# Vivado block design saturn_top, xc7a200tfbg676-2, Vivado 2023.1
# (continued, part 2 of 4)
current_bd_instance /Receiver

# ---- hierarchy /Receiver/dualDDC10 ----
current_bd_instance /Receiver/dualDDC10
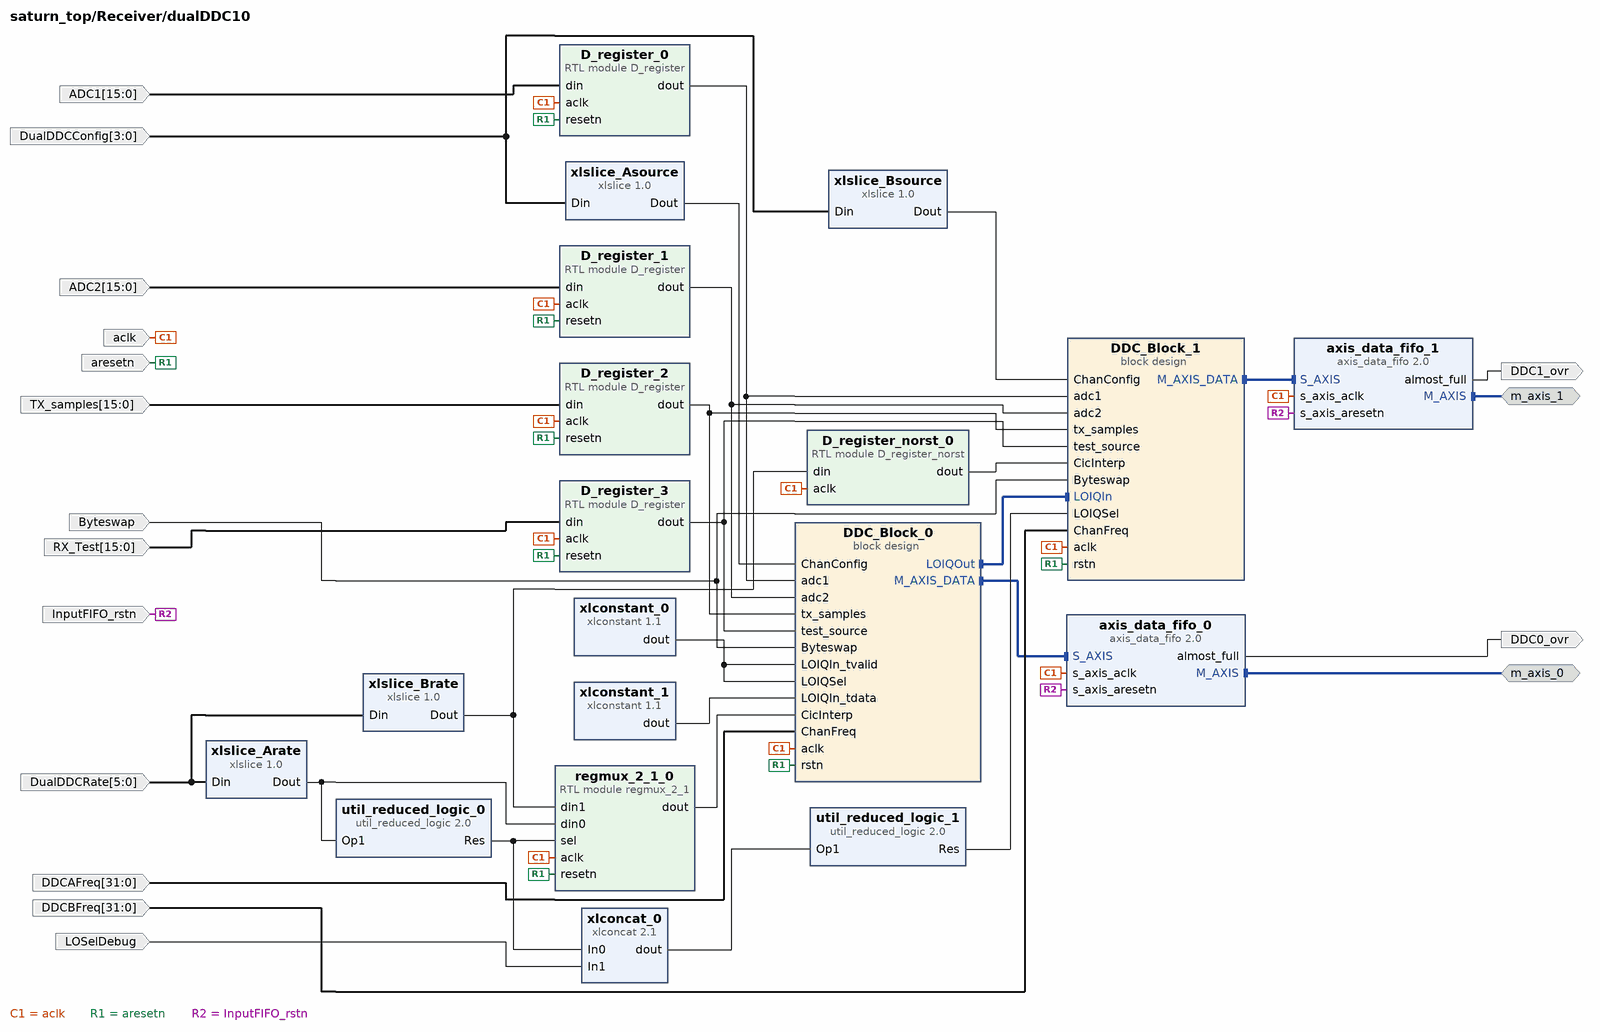
[diagram p13: block diagram inside /Receiver/dualDDC10]
create_bd_intf_pin -mode Master -vlnv xilinx.com:interface:axis_rtl:1.0 m_axis_0
create_bd_intf_pin -mode Master -vlnv xilinx.com:interface:axis_rtl:1.0 m_axis_1
create_bd_pin -dir I -from 15 -to 0 ADC1
create_bd_pin -dir I -from 15 -to 0 ADC2
create_bd_pin -dir I -from 31 -to 0 DDCAFreq
create_bd_pin -dir I -from 31 -to 0 DDCBFreq
create_bd_pin -dir I -from 15 -to 0 RX_Test
create_bd_pin -dir I -from 15 -to 0 TX_samples
create_bd_pin -dir I aclk
create_bd_pin -dir I aresetn
create_bd_pin -dir I -from 5 -to 0 DualDDCRate
create_bd_pin -dir O DDC0_ovr
create_bd_pin -dir O DDC1_ovr
create_bd_pin -dir I InputFIFO_rstn
create_bd_pin -dir I -from 3 -to 0 DualDDCConfig
create_bd_pin -dir I Byteswap
create_bd_pin -dir I LOSelDebug

create_bd_cell -type container -reference DDC_Block DDC_Block_0
set_property -dict [list \
  CONFIG.ACTIVE_SIM_BD DDC_Block.bd \
  CONFIG.ACTIVE_SYNTH_BD DDC_Block.bd \
  CONFIG.ENABLE_DFX 0 \
  CONFIG.LIST_SIM_BD DDC_Block.bd \
  CONFIG.LIST_SYNTH_BD DDC_Block.bd \
  CONFIG.LOCK_PROPAGATE 0 \
] [get_bd_cells DDC_Block_0]
create_bd_cell -type container -reference DDC_Block DDC_Block_1
set_property -dict [list \
  CONFIG.ACTIVE_SIM_BD DDC_Block.bd \
  CONFIG.ACTIVE_SYNTH_BD DDC_Block.bd \
  CONFIG.ENABLE_DFX 0 \
  CONFIG.LIST_SIM_BD DDC_Block.bd \
  CONFIG.LIST_SYNTH_BD DDC_Block.bd \
  CONFIG.LOCK_PROPAGATE 0 \
] [get_bd_cells DDC_Block_1]
create_bd_cell -type ip -vlnv xilinx.com:ip:xlslice:1.0 xlslice_Arate
set_property -dict {CONFIG.DIN_FROM 2 CONFIG.DIN_TO 0 CONFIG.DIN_WIDTH 6 CONFIG.DOUT_WIDTH 3} [get_bd_cells xlslice_Arate]
create_bd_cell -type ip -vlnv xilinx.com:ip:xlslice:1.0 xlslice_Asource
set_property -dict {CONFIG.DIN_FROM 1 CONFIG.DIN_WIDTH 4 CONFIG.DOUT_WIDTH 2} [get_bd_cells xlslice_Asource]
create_bd_cell -type ip -vlnv xilinx.com:ip:xlslice:1.0 xlslice_Brate
set_property -dict {CONFIG.DIN_FROM 5 CONFIG.DIN_TO 3 CONFIG.DIN_WIDTH 6 CONFIG.DOUT_WIDTH 3} [get_bd_cells xlslice_Brate]
create_bd_cell -type ip -vlnv xilinx.com:ip:xlslice:1.0 xlslice_Bsource
set_property -dict {CONFIG.DIN_FROM 3 CONFIG.DIN_TO 2 CONFIG.DIN_WIDTH 4 CONFIG.DOUT_WIDTH 2} [get_bd_cells xlslice_Bsource]
create_bd_cell -type ip -vlnv xilinx.com:ip:util_reduced_logic:2.0 util_reduced_logic_0
set_property -dict {CONFIG.C_SIZE 3} [get_bd_cells util_reduced_logic_0]
create_bd_cell -type module -reference D_register_norst D_register_norst_0
set_property -dict {CONFIG.DATA_WIDTH 3} [get_bd_cells D_register_norst_0]
create_bd_cell -type ip -vlnv xilinx.com:ip:axis_data_fifo:2.0 axis_data_fifo_0
set_property -dict [list \
  CONFIG.FIFO_DEPTH 128 \
  CONFIG.HAS_AFULL 1 \
  CONFIG.HAS_TKEEP 0 \
  CONFIG.HAS_TLAST 0 \
  CONFIG.HAS_TSTRB 0 \
  CONFIG.TDATA_NUM_BYTES 6 \
  CONFIG.TDEST_WIDTH 0 \
  CONFIG.TID_WIDTH 0 \
  CONFIG.TUSER_WIDTH 0 \
] [get_bd_cells axis_data_fifo_0]
create_bd_cell -type ip -vlnv xilinx.com:ip:axis_data_fifo:2.0 axis_data_fifo_1
set_property -dict [list \
  CONFIG.FIFO_DEPTH 128 \
  CONFIG.HAS_AFULL 1 \
  CONFIG.HAS_TKEEP 0 \
  CONFIG.HAS_TLAST 0 \
  CONFIG.HAS_TSTRB 0 \
  CONFIG.TDATA_NUM_BYTES 6 \
  CONFIG.TDEST_WIDTH 0 \
  CONFIG.TID_WIDTH 0 \
  CONFIG.TUSER_WIDTH 0 \
] [get_bd_cells axis_data_fifo_1]
create_bd_cell -type ip -vlnv xilinx.com:ip:xlconstant:1.1 xlconstant_0
set_property -dict {CONFIG.CONST_VAL 0} [get_bd_cells xlconstant_0]
create_bd_cell -type ip -vlnv xilinx.com:ip:xlconstant:1.1 xlconstant_1
set_property -dict {CONFIG.CONST_VAL 0 CONFIG.CONST_WIDTH 32} [get_bd_cells xlconstant_1]
create_bd_cell -type module -reference D_register D_register_0
create_bd_cell -type module -reference D_register D_register_1
create_bd_cell -type module -reference D_register D_register_2
create_bd_cell -type module -reference D_register D_register_3
create_bd_cell -type module -reference regmux_2_1 regmux_2_1_0
set_property -dict {CONFIG.DATA_WIDTH 3} [get_bd_cells regmux_2_1_0]
create_bd_cell -type ip -vlnv xilinx.com:ip:util_reduced_logic:2.0 util_reduced_logic_1
set_property -dict {CONFIG.C_SIZE 2} [get_bd_cells util_reduced_logic_1]
create_bd_cell -type ip -vlnv xilinx.com:ip:xlconcat:2.1 xlconcat_0

# ---- hierarchy /Receiver/dualDDC98 ----
current_bd_instance /Receiver/dualDDC98
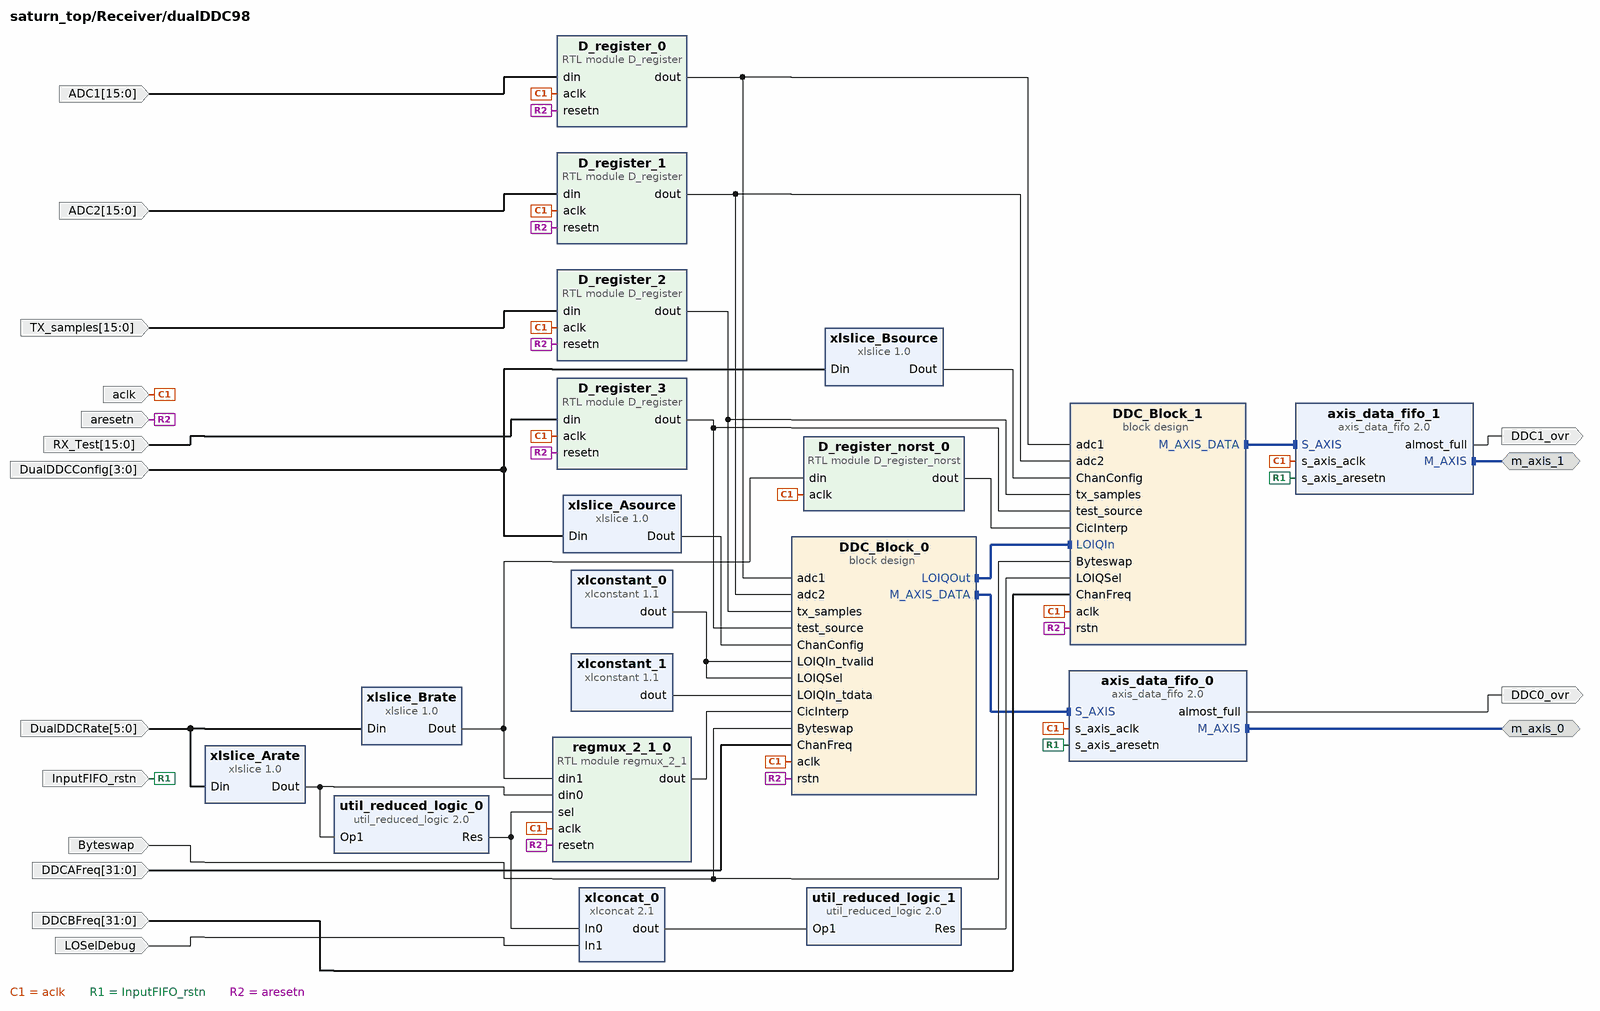
[diagram p14: block diagram inside /Receiver/dualDDC98]
create_bd_intf_pin -mode Master -vlnv xilinx.com:interface:axis_rtl:1.0 m_axis_0
create_bd_intf_pin -mode Master -vlnv xilinx.com:interface:axis_rtl:1.0 m_axis_1
create_bd_pin -dir I -from 15 -to 0 ADC1
create_bd_pin -dir I -from 15 -to 0 ADC2
create_bd_pin -dir O DDC0_ovr
create_bd_pin -dir O DDC1_ovr
create_bd_pin -dir I -from 31 -to 0 DDCAFreq
create_bd_pin -dir I -from 31 -to 0 DDCBFreq
create_bd_pin -dir I -from 5 -to 0 DualDDCRate
create_bd_pin -dir I InputFIFO_rstn
create_bd_pin -dir I -from 15 -to 0 RX_Test
create_bd_pin -dir I -from 15 -to 0 TX_samples
create_bd_pin -dir I aclk
create_bd_pin -dir I aresetn
create_bd_pin -dir I -from 3 -to 0 DualDDCConfig
create_bd_pin -dir I Byteswap
create_bd_pin -dir I LOSelDebug

create_bd_cell -type container -reference DDC_Block DDC_Block_0
set_property -dict [list \
  CONFIG.ACTIVE_SIM_BD DDC_Block.bd \
  CONFIG.ACTIVE_SYNTH_BD DDC_Block.bd \
  CONFIG.ENABLE_DFX 0 \
  CONFIG.LIST_SIM_BD DDC_Block.bd \
  CONFIG.LIST_SYNTH_BD DDC_Block.bd \
  CONFIG.LOCK_PROPAGATE 0 \
] [get_bd_cells DDC_Block_0]
create_bd_cell -type container -reference DDC_Block DDC_Block_1
set_property -dict [list \
  CONFIG.ACTIVE_SIM_BD DDC_Block.bd \
  CONFIG.ACTIVE_SYNTH_BD DDC_Block.bd \
  CONFIG.ENABLE_DFX 0 \
  CONFIG.LIST_SIM_BD DDC_Block.bd \
  CONFIG.LIST_SYNTH_BD DDC_Block.bd \
  CONFIG.LOCK_PROPAGATE 0 \
] [get_bd_cells DDC_Block_1]
create_bd_cell -type ip -vlnv xilinx.com:ip:xlslice:1.0 xlslice_Arate
set_property -dict {CONFIG.DIN_FROM 2 CONFIG.DIN_TO 0 CONFIG.DIN_WIDTH 6 CONFIG.DOUT_WIDTH 3} [get_bd_cells xlslice_Arate]
create_bd_cell -type ip -vlnv xilinx.com:ip:xlslice:1.0 xlslice_Asource
set_property -dict {CONFIG.DIN_FROM 1 CONFIG.DIN_WIDTH 4 CONFIG.DOUT_WIDTH 2} [get_bd_cells xlslice_Asource]
create_bd_cell -type ip -vlnv xilinx.com:ip:xlslice:1.0 xlslice_Brate
set_property -dict {CONFIG.DIN_FROM 5 CONFIG.DIN_TO 3 CONFIG.DIN_WIDTH 6 CONFIG.DOUT_WIDTH 3} [get_bd_cells xlslice_Brate]
create_bd_cell -type ip -vlnv xilinx.com:ip:xlslice:1.0 xlslice_Bsource
set_property -dict {CONFIG.DIN_FROM 3 CONFIG.DIN_TO 2 CONFIG.DIN_WIDTH 4 CONFIG.DOUT_WIDTH 2} [get_bd_cells xlslice_Bsource]
create_bd_cell -type ip -vlnv xilinx.com:ip:util_reduced_logic:2.0 util_reduced_logic_0
set_property -dict {CONFIG.C_SIZE 3} [get_bd_cells util_reduced_logic_0]
create_bd_cell -type module -reference D_register_norst D_register_norst_0
set_property -dict {CONFIG.DATA_WIDTH 3} [get_bd_cells D_register_norst_0]
create_bd_cell -type ip -vlnv xilinx.com:ip:axis_data_fifo:2.0 axis_data_fifo_0
set_property -dict [list \
  CONFIG.FIFO_DEPTH 128 \
  CONFIG.HAS_AFULL 1 \
  CONFIG.HAS_TKEEP 0 \
  CONFIG.HAS_TLAST 0 \
  CONFIG.HAS_TSTRB 0 \
  CONFIG.TDATA_NUM_BYTES 6 \
  CONFIG.TDEST_WIDTH 0 \
  CONFIG.TID_WIDTH 0 \
  CONFIG.TUSER_WIDTH 0 \
] [get_bd_cells axis_data_fifo_0]
create_bd_cell -type ip -vlnv xilinx.com:ip:axis_data_fifo:2.0 axis_data_fifo_1
set_property -dict [list \
  CONFIG.FIFO_DEPTH 128 \
  CONFIG.HAS_AFULL 1 \
  CONFIG.HAS_TKEEP 0 \
  CONFIG.HAS_TLAST 0 \
  CONFIG.HAS_TSTRB 0 \
  CONFIG.TDATA_NUM_BYTES 6 \
  CONFIG.TDEST_WIDTH 0 \
  CONFIG.TID_WIDTH 0 \
  CONFIG.TUSER_WIDTH 0 \
] [get_bd_cells axis_data_fifo_1]
create_bd_cell -type ip -vlnv xilinx.com:ip:xlconstant:1.1 xlconstant_0
set_property -dict {CONFIG.CONST_VAL 0} [get_bd_cells xlconstant_0]
create_bd_cell -type ip -vlnv xilinx.com:ip:xlconstant:1.1 xlconstant_1
set_property -dict {CONFIG.CONST_VAL 0 CONFIG.CONST_WIDTH 32} [get_bd_cells xlconstant_1]
create_bd_cell -type module -reference D_register D_register_0
create_bd_cell -type module -reference D_register D_register_1
create_bd_cell -type module -reference D_register D_register_2
create_bd_cell -type module -reference D_register D_register_3
create_bd_cell -type module -reference regmux_2_1 regmux_2_1_0
set_property -dict {CONFIG.DATA_WIDTH 3} [get_bd_cells regmux_2_1_0]
create_bd_cell -type ip -vlnv xilinx.com:ip:xlconcat:2.1 xlconcat_0
create_bd_cell -type ip -vlnv xilinx.com:ip:util_reduced_logic:2.0 util_reduced_logic_1
set_property -dict {CONFIG.C_SIZE 2} [get_bd_cells util_reduced_logic_1]

# ---- hierarchy /Receiver/dualDDC32 ----
current_bd_instance /Receiver/dualDDC32
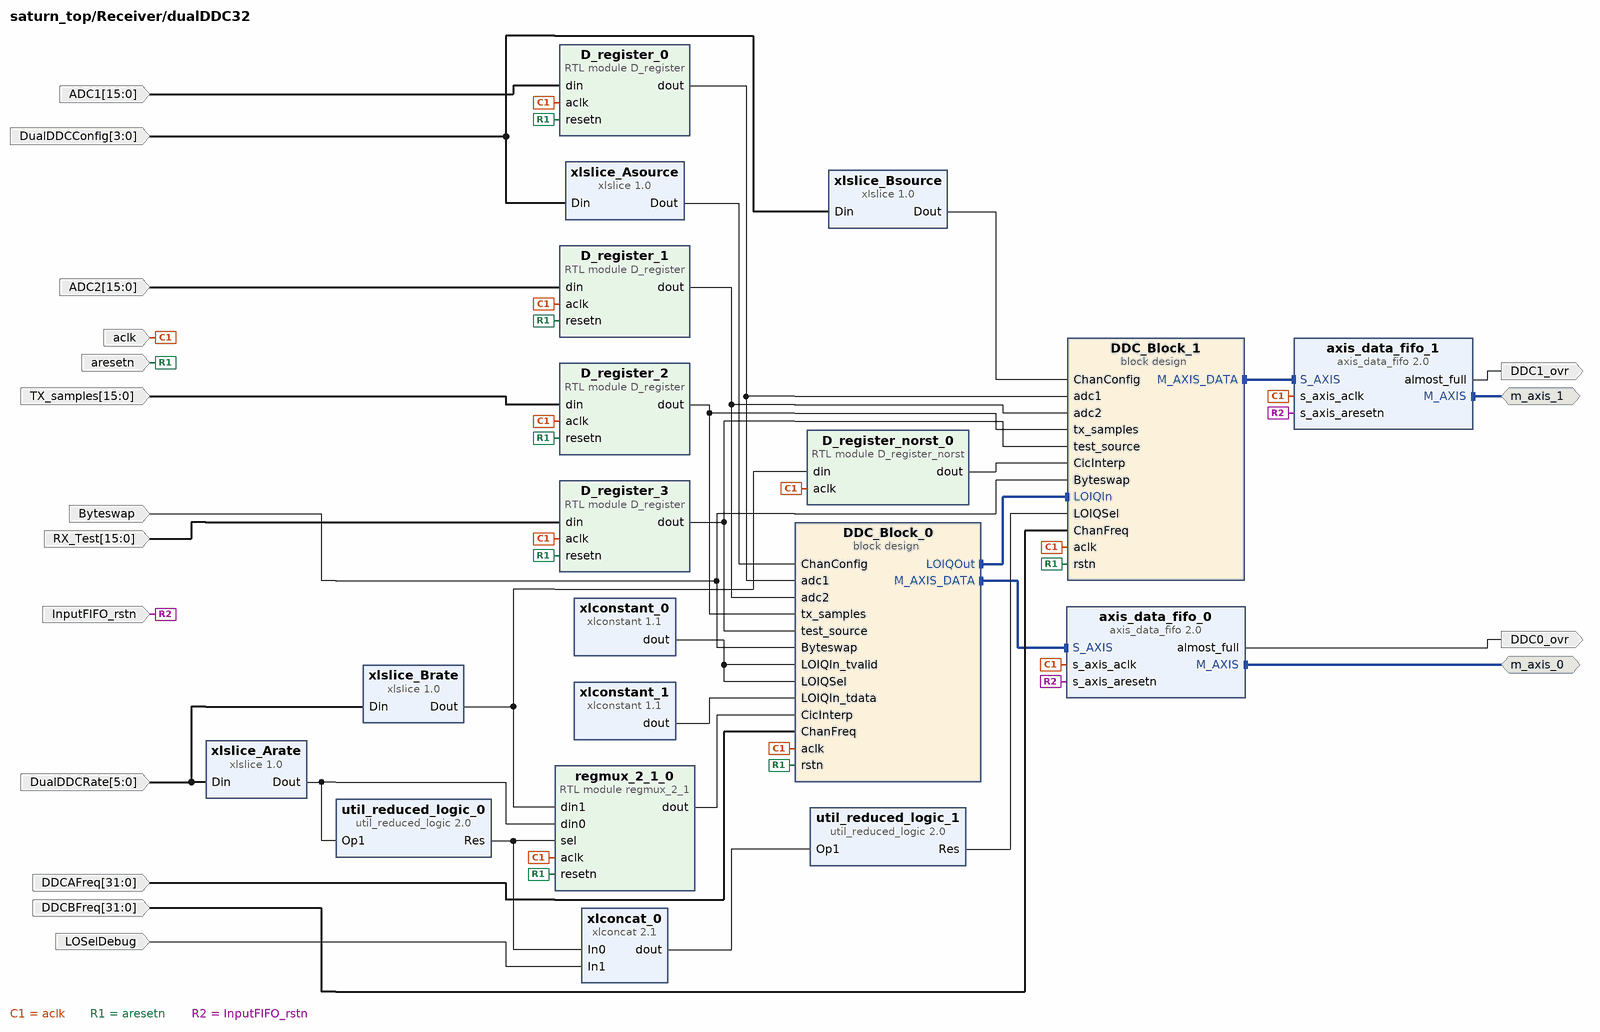
[diagram p15: block diagram inside /Receiver/dualDDC32]
create_bd_intf_pin -mode Master -vlnv xilinx.com:interface:axis_rtl:1.0 m_axis_0
create_bd_intf_pin -mode Master -vlnv xilinx.com:interface:axis_rtl:1.0 m_axis_1
create_bd_pin -dir I -from 15 -to 0 ADC1
create_bd_pin -dir I -from 15 -to 0 ADC2
create_bd_pin -dir O DDC0_ovr
create_bd_pin -dir O DDC1_ovr
create_bd_pin -dir I -from 31 -to 0 DDCAFreq
create_bd_pin -dir I -from 31 -to 0 DDCBFreq
create_bd_pin -dir I InputFIFO_rstn
create_bd_pin -dir I -from 15 -to 0 RX_Test
create_bd_pin -dir I -from 15 -to 0 TX_samples
create_bd_pin -dir I aclk
create_bd_pin -dir I aresetn
create_bd_pin -dir I -from 5 -to 0 DualDDCRate
create_bd_pin -dir I -from 3 -to 0 DualDDCConfig
create_bd_pin -dir I Byteswap
create_bd_pin -dir I LOSelDebug

create_bd_cell -type container -reference DDC_Block DDC_Block_0
set_property -dict [list \
  CONFIG.ACTIVE_SIM_BD DDC_Block.bd \
  CONFIG.ACTIVE_SYNTH_BD DDC_Block.bd \
  CONFIG.ENABLE_DFX 0 \
  CONFIG.LIST_SIM_BD DDC_Block.bd \
  CONFIG.LIST_SYNTH_BD DDC_Block.bd \
  CONFIG.LOCK_PROPAGATE 0 \
] [get_bd_cells DDC_Block_0]
create_bd_cell -type container -reference DDC_Block DDC_Block_1
set_property -dict [list \
  CONFIG.ACTIVE_SIM_BD DDC_Block.bd \
  CONFIG.ACTIVE_SYNTH_BD DDC_Block.bd \
  CONFIG.ENABLE_DFX 0 \
  CONFIG.LIST_SIM_BD DDC_Block.bd \
  CONFIG.LIST_SYNTH_BD DDC_Block.bd \
  CONFIG.LOCK_PROPAGATE 0 \
] [get_bd_cells DDC_Block_1]
create_bd_cell -type ip -vlnv xilinx.com:ip:xlslice:1.0 xlslice_Arate
set_property -dict {CONFIG.DIN_FROM 2 CONFIG.DIN_TO 0 CONFIG.DIN_WIDTH 6 CONFIG.DOUT_WIDTH 3} [get_bd_cells xlslice_Arate]
create_bd_cell -type ip -vlnv xilinx.com:ip:xlslice:1.0 xlslice_Asource
set_property -dict {CONFIG.DIN_FROM 1 CONFIG.DIN_WIDTH 4 CONFIG.DOUT_WIDTH 2} [get_bd_cells xlslice_Asource]
create_bd_cell -type ip -vlnv xilinx.com:ip:xlslice:1.0 xlslice_Brate
set_property -dict {CONFIG.DIN_FROM 5 CONFIG.DIN_TO 3 CONFIG.DIN_WIDTH 6 CONFIG.DOUT_WIDTH 3} [get_bd_cells xlslice_Brate]
create_bd_cell -type ip -vlnv xilinx.com:ip:xlslice:1.0 xlslice_Bsource
set_property -dict {CONFIG.DIN_FROM 3 CONFIG.DIN_TO 2 CONFIG.DIN_WIDTH 4 CONFIG.DOUT_WIDTH 2} [get_bd_cells xlslice_Bsource]
create_bd_cell -type ip -vlnv xilinx.com:ip:util_reduced_logic:2.0 util_reduced_logic_0
set_property -dict {CONFIG.C_SIZE 3} [get_bd_cells util_reduced_logic_0]
create_bd_cell -type module -reference D_register_norst D_register_norst_0
set_property -dict {CONFIG.DATA_WIDTH 3} [get_bd_cells D_register_norst_0]
create_bd_cell -type ip -vlnv xilinx.com:ip:axis_data_fifo:2.0 axis_data_fifo_0
set_property -dict [list \
  CONFIG.FIFO_DEPTH 128 \
  CONFIG.HAS_AFULL 1 \
  CONFIG.HAS_TKEEP 0 \
  CONFIG.HAS_TLAST 0 \
  CONFIG.HAS_TSTRB 0 \
  CONFIG.TDATA_NUM_BYTES 6 \
  CONFIG.TDEST_WIDTH 0 \
  CONFIG.TID_WIDTH 0 \
  CONFIG.TUSER_WIDTH 0 \
] [get_bd_cells axis_data_fifo_0]
create_bd_cell -type ip -vlnv xilinx.com:ip:axis_data_fifo:2.0 axis_data_fifo_1
set_property -dict [list \
  CONFIG.FIFO_DEPTH 128 \
  CONFIG.HAS_AFULL 1 \
  CONFIG.HAS_TKEEP 0 \
  CONFIG.HAS_TLAST 0 \
  CONFIG.HAS_TSTRB 0 \
  CONFIG.TDATA_NUM_BYTES 6 \
  CONFIG.TDEST_WIDTH 0 \
  CONFIG.TID_WIDTH 0 \
  CONFIG.TUSER_WIDTH 0 \
] [get_bd_cells axis_data_fifo_1]
create_bd_cell -type ip -vlnv xilinx.com:ip:xlconstant:1.1 xlconstant_0
set_property -dict {CONFIG.CONST_VAL 0} [get_bd_cells xlconstant_0]
create_bd_cell -type ip -vlnv xilinx.com:ip:xlconstant:1.1 xlconstant_1
set_property -dict {CONFIG.CONST_VAL 0 CONFIG.CONST_WIDTH 32} [get_bd_cells xlconstant_1]
create_bd_cell -type module -reference D_register D_register_0
create_bd_cell -type module -reference D_register D_register_1
create_bd_cell -type module -reference D_register D_register_2
create_bd_cell -type module -reference D_register D_register_3
create_bd_cell -type module -reference regmux_2_1 regmux_2_1_0
set_property -dict {CONFIG.DATA_WIDTH 3} [get_bd_cells regmux_2_1_0]
create_bd_cell -type ip -vlnv xilinx.com:ip:xlconcat:2.1 xlconcat_0
create_bd_cell -type ip -vlnv xilinx.com:ip:util_reduced_logic:2.0 util_reduced_logic_1
set_property -dict {CONFIG.C_SIZE 2} [get_bd_cells util_reduced_logic_1]

# ---- hierarchy /Receiver/dualDDC54 ----
current_bd_instance /Receiver/dualDDC54
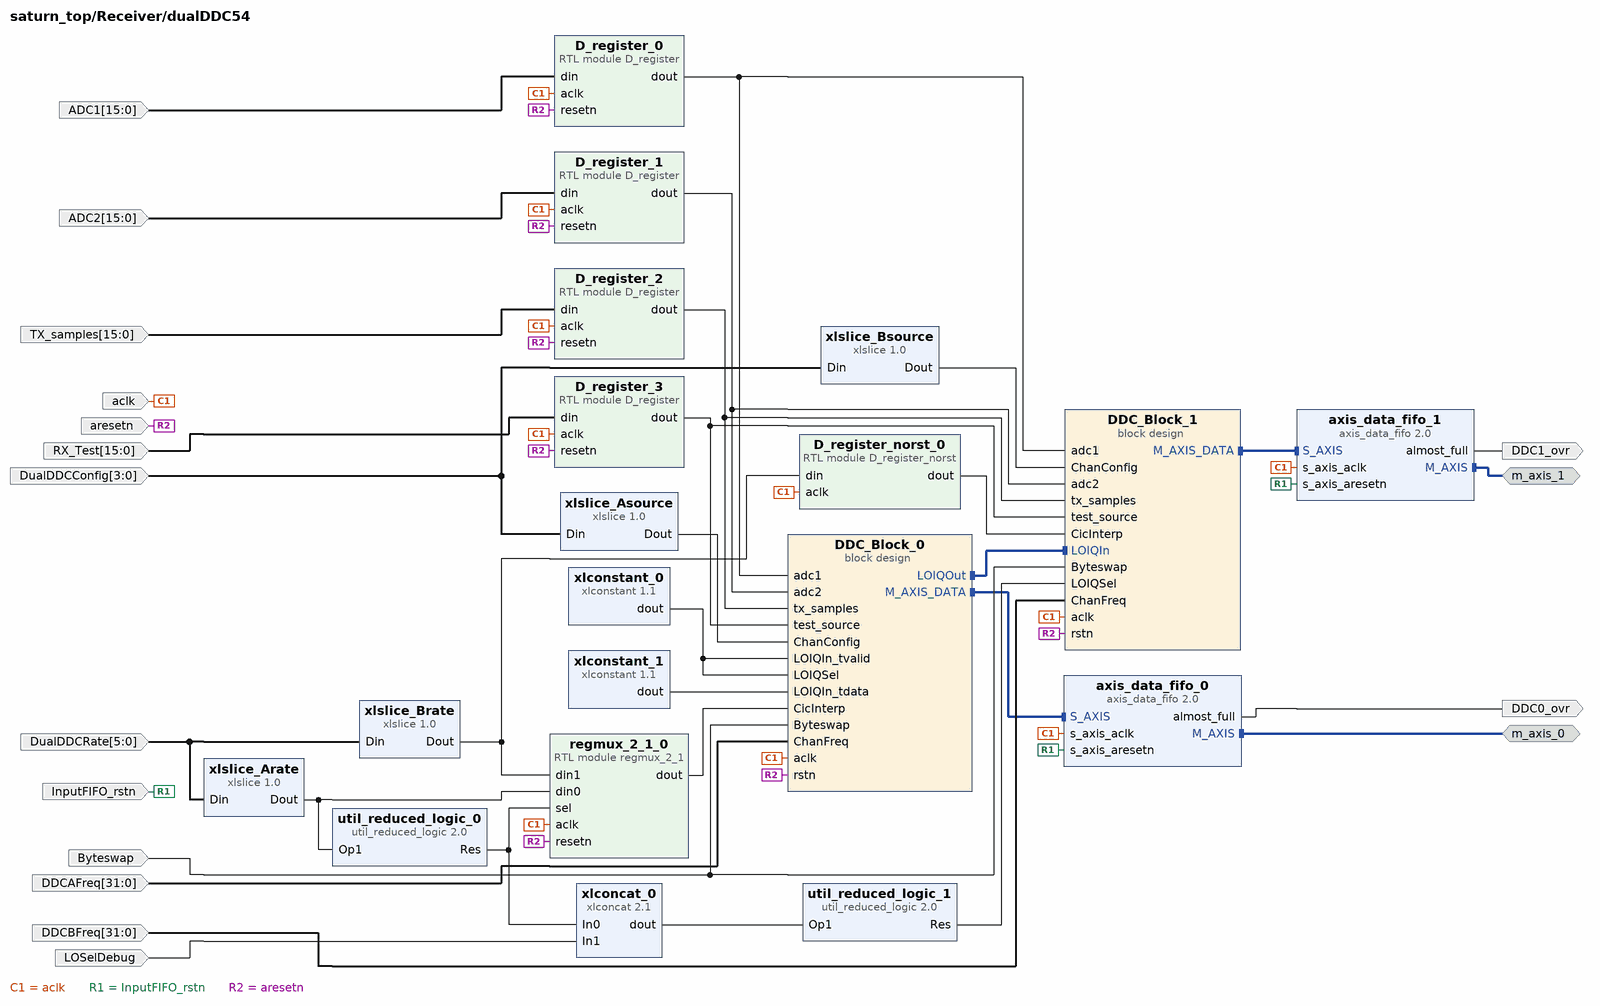
[diagram p16: block diagram inside /Receiver/dualDDC54]
create_bd_intf_pin -mode Master -vlnv xilinx.com:interface:axis_rtl:1.0 m_axis_0
create_bd_intf_pin -mode Master -vlnv xilinx.com:interface:axis_rtl:1.0 m_axis_1
create_bd_pin -dir I -from 15 -to 0 ADC1
create_bd_pin -dir I -from 15 -to 0 ADC2
create_bd_pin -dir O DDC0_ovr
create_bd_pin -dir O DDC1_ovr
create_bd_pin -dir I -from 31 -to 0 DDCAFreq
create_bd_pin -dir I -from 31 -to 0 DDCBFreq
create_bd_pin -dir I -from 5 -to 0 DualDDCRate
create_bd_pin -dir I InputFIFO_rstn
create_bd_pin -dir I -from 15 -to 0 RX_Test
create_bd_pin -dir I -from 15 -to 0 TX_samples
create_bd_pin -dir I aclk
create_bd_pin -dir I aresetn
create_bd_pin -dir I -from 3 -to 0 DualDDCConfig
create_bd_pin -dir I Byteswap
create_bd_pin -dir I LOSelDebug

create_bd_cell -type container -reference DDC_Block DDC_Block_0
set_property -dict [list \
  CONFIG.ACTIVE_SIM_BD DDC_Block.bd \
  CONFIG.ACTIVE_SYNTH_BD DDC_Block.bd \
  CONFIG.ENABLE_DFX 0 \
  CONFIG.LIST_SIM_BD DDC_Block.bd \
  CONFIG.LIST_SYNTH_BD DDC_Block.bd \
  CONFIG.LOCK_PROPAGATE 0 \
] [get_bd_cells DDC_Block_0]
create_bd_cell -type container -reference DDC_Block DDC_Block_1
set_property -dict [list \
  CONFIG.ACTIVE_SIM_BD DDC_Block.bd \
  CONFIG.ACTIVE_SYNTH_BD DDC_Block.bd \
  CONFIG.ENABLE_DFX 0 \
  CONFIG.LIST_SIM_BD DDC_Block.bd \
  CONFIG.LIST_SYNTH_BD DDC_Block.bd \
  CONFIG.LOCK_PROPAGATE 0 \
] [get_bd_cells DDC_Block_1]
create_bd_cell -type ip -vlnv xilinx.com:ip:xlslice:1.0 xlslice_Arate
set_property -dict {CONFIG.DIN_FROM 2 CONFIG.DIN_TO 0 CONFIG.DIN_WIDTH 6 CONFIG.DOUT_WIDTH 3} [get_bd_cells xlslice_Arate]
create_bd_cell -type ip -vlnv xilinx.com:ip:xlslice:1.0 xlslice_Asource
set_property -dict {CONFIG.DIN_FROM 1 CONFIG.DIN_WIDTH 4 CONFIG.DOUT_WIDTH 2} [get_bd_cells xlslice_Asource]
create_bd_cell -type ip -vlnv xilinx.com:ip:xlslice:1.0 xlslice_Brate
set_property -dict {CONFIG.DIN_FROM 5 CONFIG.DIN_TO 3 CONFIG.DIN_WIDTH 6 CONFIG.DOUT_WIDTH 3} [get_bd_cells xlslice_Brate]
create_bd_cell -type ip -vlnv xilinx.com:ip:xlslice:1.0 xlslice_Bsource
set_property -dict {CONFIG.DIN_FROM 3 CONFIG.DIN_TO 2 CONFIG.DIN_WIDTH 4 CONFIG.DOUT_WIDTH 2} [get_bd_cells xlslice_Bsource]
create_bd_cell -type ip -vlnv xilinx.com:ip:util_reduced_logic:2.0 util_reduced_logic_0
set_property -dict {CONFIG.C_SIZE 3} [get_bd_cells util_reduced_logic_0]
create_bd_cell -type module -reference D_register_norst D_register_norst_0
set_property -dict {CONFIG.DATA_WIDTH 3} [get_bd_cells D_register_norst_0]
create_bd_cell -type ip -vlnv xilinx.com:ip:axis_data_fifo:2.0 axis_data_fifo_0
set_property -dict [list \
  CONFIG.FIFO_DEPTH 128 \
  CONFIG.HAS_AFULL 1 \
  CONFIG.HAS_TKEEP 0 \
  CONFIG.HAS_TLAST 0 \
  CONFIG.HAS_TSTRB 0 \
  CONFIG.TDATA_NUM_BYTES 6 \
  CONFIG.TDEST_WIDTH 0 \
  CONFIG.TID_WIDTH 0 \
  CONFIG.TUSER_WIDTH 0 \
] [get_bd_cells axis_data_fifo_0]
create_bd_cell -type ip -vlnv xilinx.com:ip:axis_data_fifo:2.0 axis_data_fifo_1
set_property -dict [list \
  CONFIG.FIFO_DEPTH 128 \
  CONFIG.HAS_AFULL 1 \
  CONFIG.HAS_TKEEP 0 \
  CONFIG.HAS_TLAST 0 \
  CONFIG.HAS_TSTRB 0 \
  CONFIG.TDATA_NUM_BYTES 6 \
  CONFIG.TDEST_WIDTH 0 \
  CONFIG.TID_WIDTH 0 \
  CONFIG.TUSER_WIDTH 0 \
] [get_bd_cells axis_data_fifo_1]
create_bd_cell -type ip -vlnv xilinx.com:ip:xlconstant:1.1 xlconstant_0
set_property -dict {CONFIG.CONST_VAL 0} [get_bd_cells xlconstant_0]
create_bd_cell -type ip -vlnv xilinx.com:ip:xlconstant:1.1 xlconstant_1
set_property -dict {CONFIG.CONST_VAL 0 CONFIG.CONST_WIDTH 32} [get_bd_cells xlconstant_1]
create_bd_cell -type module -reference D_register D_register_0
create_bd_cell -type module -reference D_register D_register_1
create_bd_cell -type module -reference D_register D_register_2
create_bd_cell -type module -reference D_register D_register_3
create_bd_cell -type module -reference regmux_2_1 regmux_2_1_0
set_property -dict {CONFIG.DATA_WIDTH 3} [get_bd_cells regmux_2_1_0]
create_bd_cell -type ip -vlnv xilinx.com:ip:xlconcat:2.1 xlconcat_0
create_bd_cell -type ip -vlnv xilinx.com:ip:util_reduced_logic:2.0 util_reduced_logic_1
set_property -dict {CONFIG.C_SIZE 2} [get_bd_cells util_reduced_logic_1]

# ---- hierarchy /Receiver/dualDDC76 ----
current_bd_instance /Receiver/dualDDC76
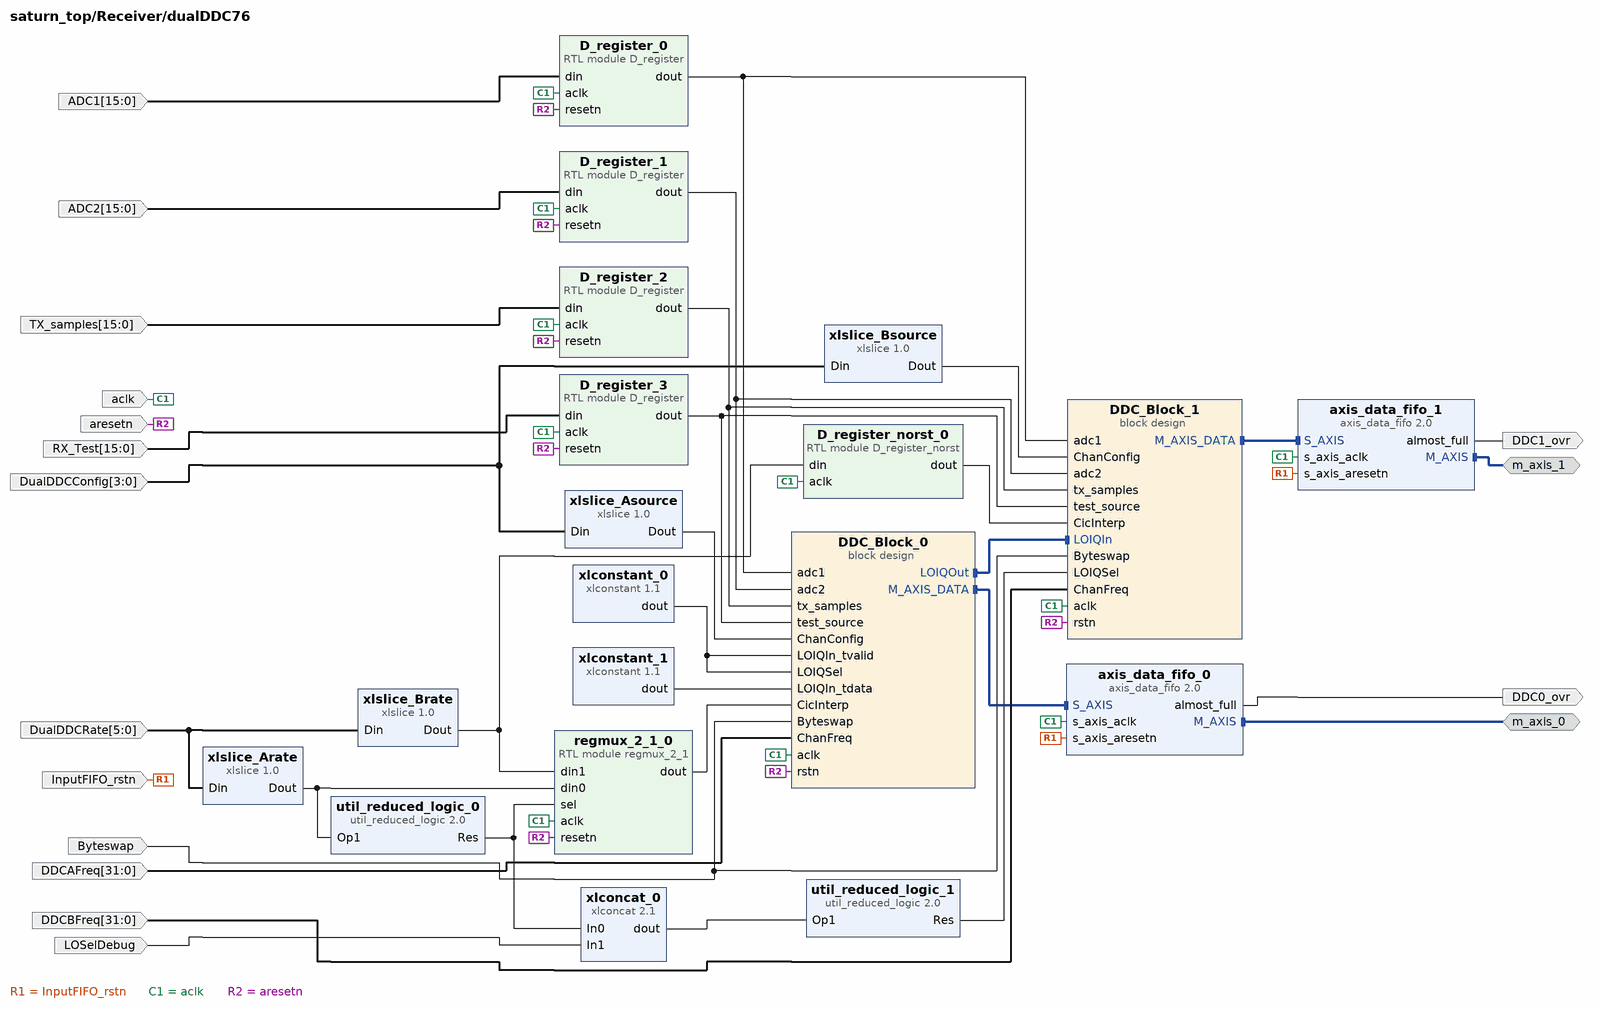
[diagram p17: block diagram inside /Receiver/dualDDC76]
create_bd_intf_pin -mode Master -vlnv xilinx.com:interface:axis_rtl:1.0 m_axis_0
create_bd_intf_pin -mode Master -vlnv xilinx.com:interface:axis_rtl:1.0 m_axis_1
create_bd_pin -dir I -from 15 -to 0 ADC1
create_bd_pin -dir I -from 15 -to 0 ADC2
create_bd_pin -dir O DDC0_ovr
create_bd_pin -dir O DDC1_ovr
create_bd_pin -dir I -from 31 -to 0 DDCAFreq
create_bd_pin -dir I -from 31 -to 0 DDCBFreq
create_bd_pin -dir I -from 5 -to 0 DualDDCRate
create_bd_pin -dir I InputFIFO_rstn
create_bd_pin -dir I -from 15 -to 0 RX_Test
create_bd_pin -dir I -from 15 -to 0 TX_samples
create_bd_pin -dir I aclk
create_bd_pin -dir I aresetn
create_bd_pin -dir I -from 3 -to 0 DualDDCConfig
create_bd_pin -dir I Byteswap
create_bd_pin -dir I LOSelDebug

create_bd_cell -type container -reference DDC_Block DDC_Block_0
set_property -dict [list \
  CONFIG.ACTIVE_SIM_BD DDC_Block.bd \
  CONFIG.ACTIVE_SYNTH_BD DDC_Block.bd \
  CONFIG.ENABLE_DFX 0 \
  CONFIG.LIST_SIM_BD DDC_Block.bd \
  CONFIG.LIST_SYNTH_BD DDC_Block.bd \
  CONFIG.LOCK_PROPAGATE 0 \
] [get_bd_cells DDC_Block_0]
create_bd_cell -type container -reference DDC_Block DDC_Block_1
set_property -dict [list \
  CONFIG.ACTIVE_SIM_BD DDC_Block.bd \
  CONFIG.ACTIVE_SYNTH_BD DDC_Block.bd \
  CONFIG.ENABLE_DFX 0 \
  CONFIG.LIST_SIM_BD DDC_Block.bd \
  CONFIG.LIST_SYNTH_BD DDC_Block.bd \
  CONFIG.LOCK_PROPAGATE 0 \
] [get_bd_cells DDC_Block_1]
create_bd_cell -type ip -vlnv xilinx.com:ip:xlslice:1.0 xlslice_Arate
set_property -dict {CONFIG.DIN_FROM 2 CONFIG.DIN_TO 0 CONFIG.DIN_WIDTH 6 CONFIG.DOUT_WIDTH 3} [get_bd_cells xlslice_Arate]
create_bd_cell -type ip -vlnv xilinx.com:ip:xlslice:1.0 xlslice_Asource
set_property -dict {CONFIG.DIN_FROM 1 CONFIG.DIN_WIDTH 4 CONFIG.DOUT_WIDTH 2} [get_bd_cells xlslice_Asource]
create_bd_cell -type ip -vlnv xilinx.com:ip:xlslice:1.0 xlslice_Brate
set_property -dict {CONFIG.DIN_FROM 5 CONFIG.DIN_TO 3 CONFIG.DIN_WIDTH 6 CONFIG.DOUT_WIDTH 3} [get_bd_cells xlslice_Brate]
create_bd_cell -type ip -vlnv xilinx.com:ip:xlslice:1.0 xlslice_Bsource
set_property -dict {CONFIG.DIN_FROM 3 CONFIG.DIN_TO 2 CONFIG.DIN_WIDTH 4 CONFIG.DOUT_WIDTH 2} [get_bd_cells xlslice_Bsource]
create_bd_cell -type ip -vlnv xilinx.com:ip:util_reduced_logic:2.0 util_reduced_logic_0
set_property -dict {CONFIG.C_SIZE 3} [get_bd_cells util_reduced_logic_0]
create_bd_cell -type module -reference D_register_norst D_register_norst_0
set_property -dict {CONFIG.DATA_WIDTH 3} [get_bd_cells D_register_norst_0]
create_bd_cell -type ip -vlnv xilinx.com:ip:axis_data_fifo:2.0 axis_data_fifo_0
set_property -dict [list \
  CONFIG.FIFO_DEPTH 128 \
  CONFIG.HAS_AFULL 1 \
  CONFIG.HAS_TKEEP 0 \
  CONFIG.HAS_TLAST 0 \
  CONFIG.HAS_TSTRB 0 \
  CONFIG.TDATA_NUM_BYTES 6 \
  CONFIG.TDEST_WIDTH 0 \
  CONFIG.TID_WIDTH 0 \
  CONFIG.TUSER_WIDTH 0 \
] [get_bd_cells axis_data_fifo_0]
create_bd_cell -type ip -vlnv xilinx.com:ip:axis_data_fifo:2.0 axis_data_fifo_1
set_property -dict [list \
  CONFIG.FIFO_DEPTH 128 \
  CONFIG.HAS_AFULL 1 \
  CONFIG.HAS_TKEEP 0 \
  CONFIG.HAS_TLAST 0 \
  CONFIG.HAS_TSTRB 0 \
  CONFIG.TDATA_NUM_BYTES 6 \
  CONFIG.TDEST_WIDTH 0 \
  CONFIG.TID_WIDTH 0 \
  CONFIG.TUSER_WIDTH 0 \
] [get_bd_cells axis_data_fifo_1]
create_bd_cell -type ip -vlnv xilinx.com:ip:xlconstant:1.1 xlconstant_0
set_property -dict {CONFIG.CONST_VAL 0} [get_bd_cells xlconstant_0]
create_bd_cell -type ip -vlnv xilinx.com:ip:xlconstant:1.1 xlconstant_1
set_property -dict {CONFIG.CONST_VAL 0 CONFIG.CONST_WIDTH 32} [get_bd_cells xlconstant_1]
create_bd_cell -type module -reference D_register D_register_0
create_bd_cell -type module -reference D_register D_register_1
create_bd_cell -type module -reference D_register D_register_2
create_bd_cell -type module -reference D_register D_register_3
create_bd_cell -type module -reference regmux_2_1 regmux_2_1_0
set_property -dict {CONFIG.DATA_WIDTH 3} [get_bd_cells regmux_2_1_0]
create_bd_cell -type ip -vlnv xilinx.com:ip:xlconcat:2.1 xlconcat_0
create_bd_cell -type ip -vlnv xilinx.com:ip:util_reduced_logic:2.0 util_reduced_logic_1
set_property -dict {CONFIG.C_SIZE 2} [get_bd_cells util_reduced_logic_1]

# ---- hierarchy /Transmitter ----
current_bd_instance /Transmitter
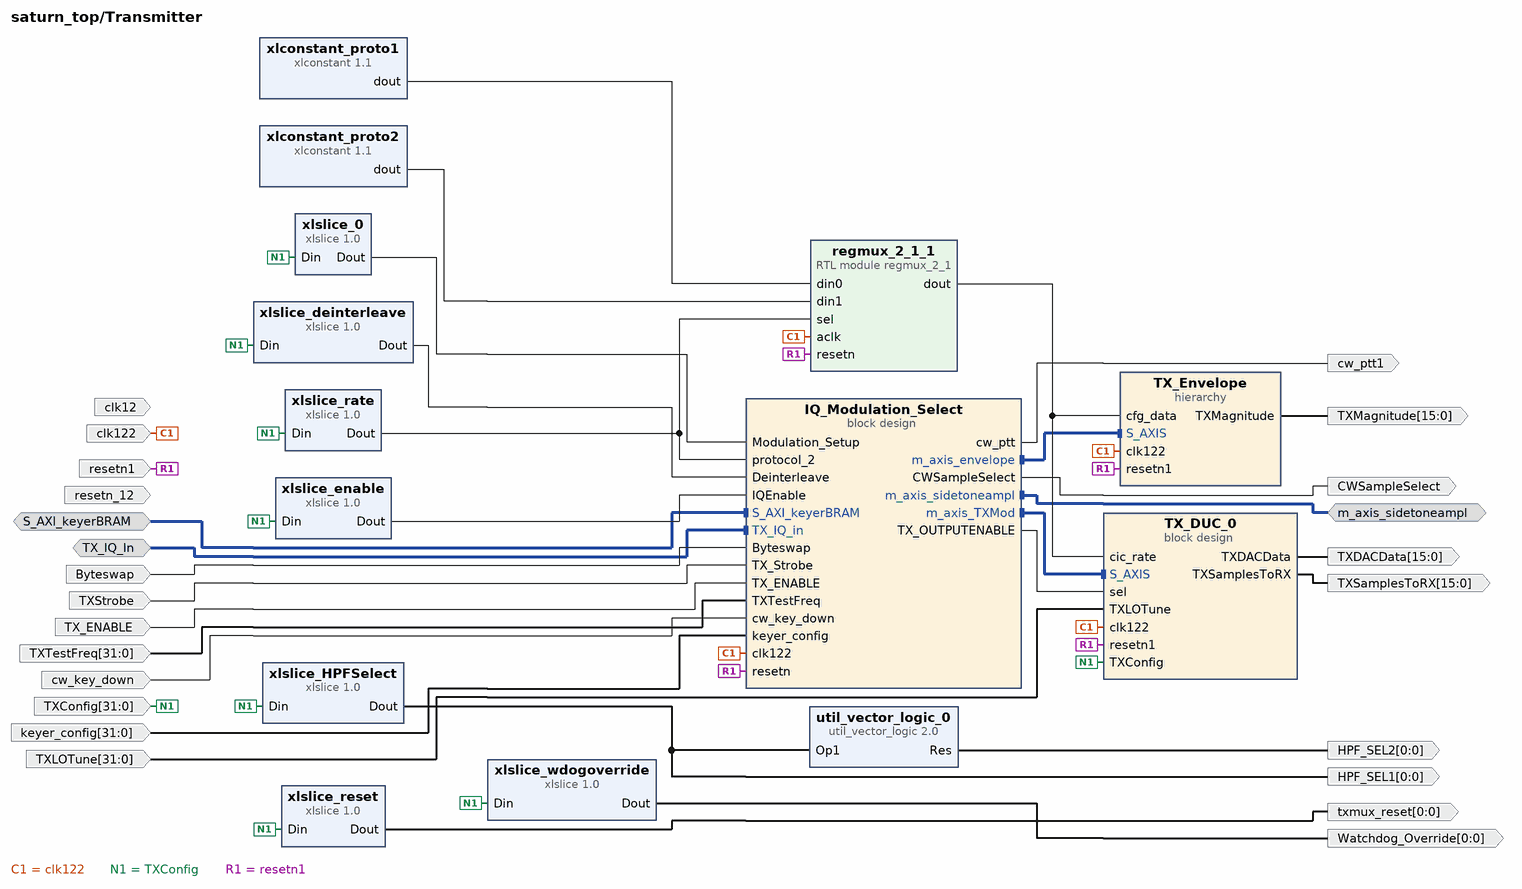
[diagram p18: block diagram inside /Transmitter]
create_bd_intf_pin -mode Slave -vlnv xilinx.com:interface:aximm_rtl:1.0 S_AXI_keyerBRAM
create_bd_intf_pin -mode Slave -vlnv xilinx.com:interface:axis_rtl:1.0 TX_IQ_In
create_bd_intf_pin -mode Master -vlnv xilinx.com:interface:axis_rtl:1.0 m_axis_sidetoneampl
create_bd_pin -dir O CWSampleSelect
create_bd_pin -dir I -from 31 -to 0 TXConfig
create_bd_pin -dir O -from 15 -to 0 TXDACData
create_bd_pin -dir I -from 31 -to 0 TXLOTune
create_bd_pin -dir O -from 15 -to 0 TXMagnitude
create_bd_pin -dir O -from 15 -to 0 TXSamplesToRX
create_bd_pin -dir I TXStrobe
create_bd_pin -dir I -from 31 -to 0 TXTestFreq
create_bd_pin -dir I TX_ENABLE
create_bd_pin -dir I clk12
create_bd_pin -dir I -type clk clk122
create_bd_pin -dir I cw_key_down
create_bd_pin -dir O cw_ptt1
create_bd_pin -dir I -from 31 -to 0 keyer_config
create_bd_pin -dir I -type rst resetn1
create_bd_pin -dir I resetn_12
create_bd_pin -dir I Byteswap
create_bd_pin -dir O -from 0 -to 0 txmux_reset
create_bd_pin -dir O -from 0 -to 0 Watchdog_Override
create_bd_pin -dir O -from 0 -to 0 HPF_SEL1
create_bd_pin -dir O -from 0 -to 0 HPF_SEL2

create_bd_cell -type container -reference IQ_Modulation_Select IQ_Modulation_Select
set_property -dict [list \
  CONFIG.ACTIVE_SIM_BD IQ_Modulation_Select.bd \
  CONFIG.ACTIVE_SYNTH_BD IQ_Modulation_Select.bd \
  CONFIG.ENABLE_DFX 0 \
  CONFIG.LIST_SIM_BD IQ_Modulation_Select.bd \
  CONFIG.LIST_SYNTH_BD IQ_Modulation_Select.bd \
  CONFIG.LOCK_PROPAGATE 0 \
] [get_bd_cells IQ_Modulation_Select]
create_bd_cell -type container -reference TX_DUC TX_DUC_0
set_property -dict [list \
  CONFIG.ACTIVE_SIM_BD TX_DUC.bd \
  CONFIG.ACTIVE_SYNTH_BD TX_DUC.bd \
  CONFIG.ENABLE_DFX 0 \
  CONFIG.LIST_SIM_BD TX_DUC.bd \
  CONFIG.LIST_SYNTH_BD TX_DUC.bd \
  CONFIG.LOCK_PROPAGATE 0 \
] [get_bd_cells TX_DUC_0]
create_bd_cell -type hier TX_Envelope
create_bd_cell -type ip -vlnv xilinx.com:ip:xlslice:1.0 xlslice_0
set_property -dict {CONFIG.DIN_FROM 2 CONFIG.DOUT_WIDTH 3} [get_bd_cells xlslice_0]
create_bd_cell -type ip -vlnv xilinx.com:ip:xlslice:1.0 xlslice_deinterleave
set_property -dict [list \
  CONFIG.DIN_FROM 30 \
  CONFIG.DIN_TO 30 \
  CONFIG.DIN_WIDTH 32 \
  CONFIG.DOUT_WIDTH 1 \
] [get_bd_cells xlslice_deinterleave]
create_bd_cell -type ip -vlnv xilinx.com:ip:xlslice:1.0 xlslice_enable
set_property -dict {CONFIG.DIN_FROM 31 CONFIG.DIN_TO 31 CONFIG.DIN_WIDTH 32 CONFIG.DOUT_WIDTH 1} [get_bd_cells xlslice_enable]
create_bd_cell -type ip -vlnv xilinx.com:ip:xlslice:1.0 xlslice_rate
set_property -dict {CONFIG.DIN_FROM 3 CONFIG.DIN_TO 3 CONFIG.DIN_WIDTH 32 CONFIG.DOUT_WIDTH 1} [get_bd_cells xlslice_rate]
create_bd_cell -type ip -vlnv xilinx.com:ip:xlslice:1.0 xlslice_reset
set_property -dict {CONFIG.DIN_FROM 29 CONFIG.DIN_TO 29 CONFIG.DIN_WIDTH 32 CONFIG.DOUT_WIDTH 1} [get_bd_cells xlslice_reset]
create_bd_cell -type ip -vlnv xilinx.com:ip:xlconstant:1.1 xlconstant_proto1
set_property -dict {CONFIG.CONST_VAL 320 CONFIG.CONST_WIDTH 16} [get_bd_cells xlconstant_proto1]
create_bd_cell -type ip -vlnv xilinx.com:ip:xlconstant:1.1 xlconstant_proto2
set_property -dict {CONFIG.CONST_VAL 80 CONFIG.CONST_WIDTH 16} [get_bd_cells xlconstant_proto2]
create_bd_cell -type module -reference regmux_2_1 regmux_2_1_1
create_bd_cell -type ip -vlnv xilinx.com:ip:xlslice:1.0 xlslice_wdogoverride
set_property -dict {CONFIG.DIN_FROM 28 CONFIG.DIN_TO 28} [get_bd_cells xlslice_wdogoverride]
create_bd_cell -type ip -vlnv xilinx.com:ip:xlslice:1.0 xlslice_HPFSelect
set_property -dict {CONFIG.DIN_FROM 27 CONFIG.DIN_TO 27} [get_bd_cells xlslice_HPFSelect]
create_bd_cell -type ip -vlnv xilinx.com:ip:util_vector_logic:2.0 util_vector_logic_0
set_property -dict {CONFIG.C_OPERATION not CONFIG.C_SIZE 1} [get_bd_cells util_vector_logic_0]

# ---- hierarchy /Transmitter/TX_Envelope ----
current_bd_instance /Transmitter/TX_Envelope
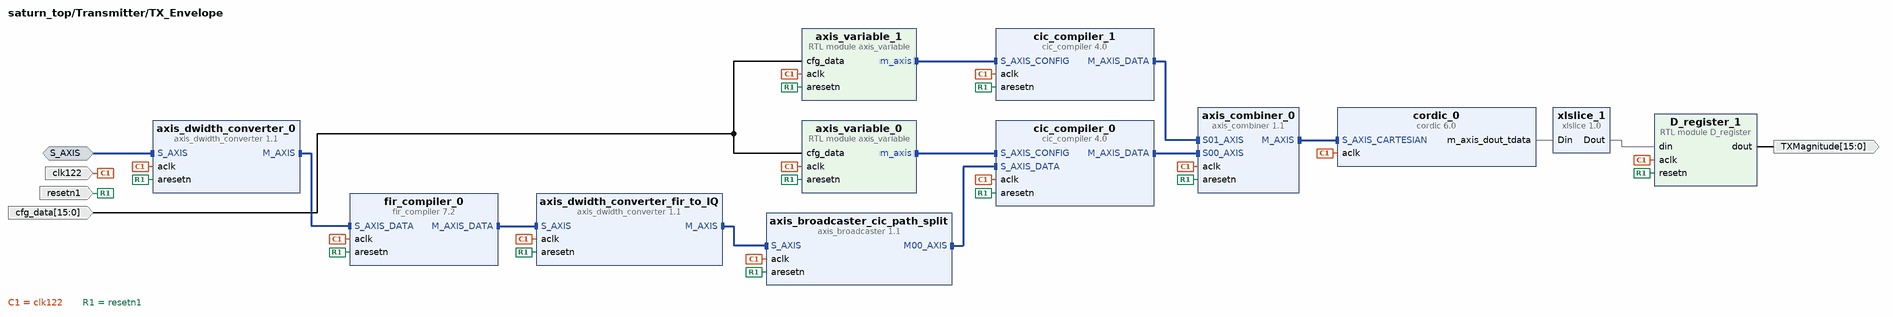
[diagram p19: block diagram inside /Transmitter/TX_Envelope]
create_bd_intf_pin -mode Slave -vlnv xilinx.com:interface:axis_rtl:1.0 S_AXIS
create_bd_pin -dir O -from 15 -to 0 TXMagnitude
create_bd_pin -dir I -from 15 -to 0 cfg_data
create_bd_pin -dir I -type clk clk122
create_bd_pin -dir I -type rst resetn1

create_bd_cell -type ip -vlnv xilinx.com:ip:xlslice:1.0 xlslice_1
set_property -dict {CONFIG.DIN_FROM 15 CONFIG.DOUT_WIDTH 16} [get_bd_cells xlslice_1]
create_bd_cell -type module -reference axis_variable axis_variable_1
set_property -dict {CONFIG.AXIS_TDATA_WIDTH 16} [get_bd_cells axis_variable_1]
create_bd_cell -type ip -vlnv xilinx.com:ip:axis_broadcaster:1.1 axis_broadcaster_cic_path_split
set_property -dict [list \
  CONFIG.M00_TDATA_REMAP {tdata[23:0]} \
  CONFIG.M01_TDATA_REMAP {tdata[47:24]} \
  CONFIG.M_TDATA_NUM_BYTES 3 \
  CONFIG.S_TDATA_NUM_BYTES 6 \
] [get_bd_cells axis_broadcaster_cic_path_split]
create_bd_cell -type ip -vlnv xilinx.com:ip:axis_combiner:1.1 axis_combiner_0
set_property -dict {CONFIG.TDATA_NUM_BYTES 3} [get_bd_cells axis_combiner_0]
create_bd_cell -type ip -vlnv xilinx.com:ip:axis_dwidth_converter:1.1 axis_dwidth_converter_0
set_property -dict [list \
  CONFIG.HAS_TKEEP 0 \
  CONFIG.HAS_TLAST 0 \
  CONFIG.HAS_TSTRB 0 \
  CONFIG.M_TDATA_NUM_BYTES 3 \
  CONFIG.S_TDATA_NUM_BYTES 6 \
  CONFIG.TDEST_WIDTH 0 \
  CONFIG.TID_WIDTH 0 \
] [get_bd_cells axis_dwidth_converter_0]
create_bd_cell -type ip -vlnv xilinx.com:ip:axis_dwidth_converter:1.1 axis_dwidth_converter_fir_to_IQ
set_property -dict {CONFIG.M_TDATA_NUM_BYTES 6 CONFIG.S_TDATA_NUM_BYTES 3} [get_bd_cells axis_dwidth_converter_fir_to_IQ]
create_bd_cell -type ip -vlnv xilinx.com:ip:cic_compiler:4.0 cic_compiler_0
set_property -dict [list \
  CONFIG.Clock_Frequency 122.88 \
  CONFIG.Fixed_Or_Initial_Rate 80 \
  CONFIG.HAS_ARESETN true \
  CONFIG.HAS_DOUT_TREADY false \
  CONFIG.Input_Data_Width 24 \
  CONFIG.Input_Sample_Frequency 1.536 \
  CONFIG.Maximum_Rate 320 \
  CONFIG.Minimum_Rate 80 \
  CONFIG.Number_Of_Stages 6 \
  CONFIG.Output_Data_Width 24 \
  CONFIG.Quantization Truncation \
  CONFIG.SamplePeriod 80 \
  CONFIG.Sample_Rate_Changes Programmable \
  CONFIG.Use_Xtreme_DSP_Slice false \
] [get_bd_cells cic_compiler_0]
create_bd_cell -type ip -vlnv xilinx.com:ip:cic_compiler:4.0 cic_compiler_1
set_property -dict [list \
  CONFIG.Clock_Frequency 122.88 \
  CONFIG.Fixed_Or_Initial_Rate 80 \
  CONFIG.HAS_ARESETN true \
  CONFIG.HAS_DOUT_TREADY false \
  CONFIG.Input_Data_Width 24 \
  CONFIG.Input_Sample_Frequency 1.536 \
  CONFIG.Maximum_Rate 320 \
  CONFIG.Minimum_Rate 80 \
  CONFIG.Number_Of_Stages 6 \
  CONFIG.Output_Data_Width 24 \
  CONFIG.Quantization Truncation \
  CONFIG.SamplePeriod 80 \
  CONFIG.Sample_Rate_Changes Programmable \
  CONFIG.Use_Xtreme_DSP_Slice false \
] [get_bd_cells cic_compiler_1]
create_bd_cell -type ip -vlnv xilinx.com:ip:cordic:6.0 cordic_0
set_property -dict [list \
  CONFIG.Compensation_Scaling No_Scale_Compensation \
  CONFIG.Data_Format SignedFraction \
  CONFIG.Functional_Selection Translate \
  CONFIG.Input_Width 23 \
  CONFIG.Output_Width 16 \
  CONFIG.flow_control NonBlocking \
] [get_bd_cells cordic_0]
create_bd_cell -type ip -vlnv xilinx.com:ip:fir_compiler:7.2 fir_compiler_0
set_property -dict [list \
  CONFIG.BestPrecision true \
  CONFIG.Clock_Frequency 122.88 \
  CONFIG.CoefficientSource COE_File \
  CONFIG.Coefficient_File ../../../../../../../sources/coefficientfiles/tx1024cfirImpulse.coe \
  CONFIG.Coefficient_Fractional_Bits 24 \
  CONFIG.Coefficient_Sets 1 \
  CONFIG.Coefficient_Sign Signed \
  CONFIG.Coefficient_Structure Inferred \
  CONFIG.Coefficient_Width 22 \
  CONFIG.ColumnConfig 2 \
  CONFIG.DATA_Has_TLAST Not_Required \
  CONFIG.Data_Fractional_Bits 0 \
  CONFIG.Data_Width 24 \
  CONFIG.Decimation_Rate 1 \
  CONFIG.Filter_Architecture Systolic_Multiply_Accumulate \
  CONFIG.Filter_Type Interpolation \
  CONFIG.Has_ARESETn true \
  CONFIG.Interpolation_Rate 8 \
  CONFIG.M_DATA_Has_TREADY true \
  CONFIG.M_DATA_Has_TUSER Not_Required \
  CONFIG.Number_Channels 2 \
  CONFIG.Output_Rounding_Mode Truncate_LSBs \
  CONFIG.Output_Width 24 \
  CONFIG.Quantization Quantize_Only \
  CONFIG.RateSpecification Frequency_Specification \
  CONFIG.S_DATA_Has_TUSER Not_Required \
  CONFIG.Sample_Frequency 0.192 \
  CONFIG.Select_Pattern All \
  CONFIG.Zero_Pack_Factor 1 \
] [get_bd_cells fir_compiler_0]
create_bd_cell -type module -reference D_register D_register_1
create_bd_cell -type module -reference axis_variable axis_variable_0
set_property -dict {CONFIG.AXIS_TDATA_WIDTH 16} [get_bd_cells axis_variable_0]

# ---- hierarchy /clock_generator ----
current_bd_instance /clock_generator
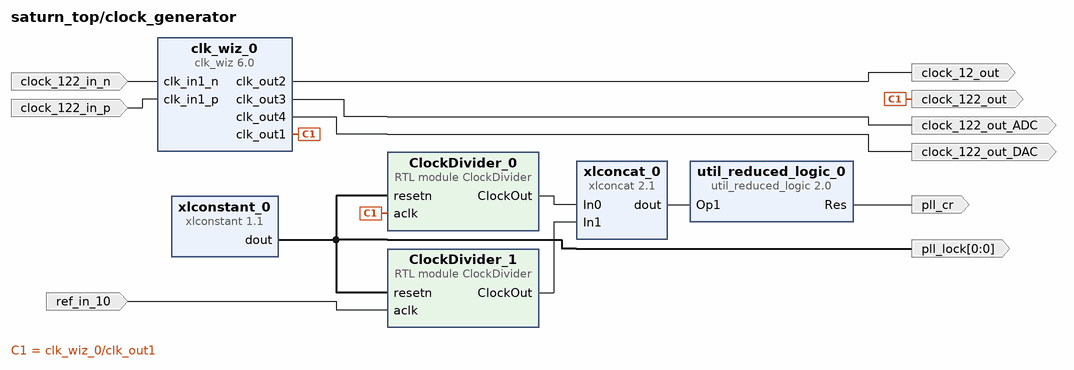
[diagram p20: block diagram inside /clock_generator]
create_bd_pin -dir I clock_122_in_n
create_bd_pin -dir I -type clk clock_122_in_p
create_bd_pin -dir O -type clk clock_122_out
create_bd_pin -dir O clock_122_out_ADC
create_bd_pin -dir O -type clk clock_12_out
create_bd_pin -dir O pll_cr
create_bd_pin -dir O -from 0 -to 0 pll_lock
create_bd_pin -dir O clock_122_out_DAC
create_bd_pin -dir I ref_in_10

create_bd_cell -type ip -vlnv xilinx.com:ip:util_reduced_logic:2.0 util_reduced_logic_0
set_property -dict {CONFIG.C_OPERATION xor CONFIG.C_SIZE 2} [get_bd_cells util_reduced_logic_0]
create_bd_cell -type ip -vlnv xilinx.com:ip:xlconcat:2.1 xlconcat_0
create_bd_cell -type module -reference ClockDivider ClockDivider_0
set_property -dict {CONFIG.Divisor 3072} [get_bd_cells ClockDivider_0]
create_bd_cell -type module -reference ClockDivider ClockDivider_1
set_property -dict {CONFIG.Divisor 250} [get_bd_cells ClockDivider_1]
create_bd_cell -type ip -vlnv xilinx.com:ip:clk_wiz:6.0 clk_wiz_0
set_property -dict [list \
  CONFIG.CLKIN1_JITTER_PS 81.38 \
  CONFIG.CLKOUT1_DRIVES BUFG \
  CONFIG.CLKOUT1_JITTER 121.076 \
  CONFIG.CLKOUT1_PHASE_ERROR 98.137 \
  CONFIG.CLKOUT1_REQUESTED_OUT_FREQ 122.88 \
  CONFIG.CLKOUT2_DRIVES BUFG \
  CONFIG.CLKOUT2_JITTER 192.138 \
  CONFIG.CLKOUT2_PHASE_ERROR 98.137 \
  CONFIG.CLKOUT2_REQUESTED_OUT_FREQ 12.288 \
  CONFIG.CLKOUT2_USED true \
  CONFIG.CLKOUT3_DRIVES BUFG \
  CONFIG.CLKOUT3_JITTER 121.076 \
  CONFIG.CLKOUT3_PHASE_ERROR 98.137 \
  CONFIG.CLKOUT3_REQUESTED_OUT_FREQ 122.88 \
  CONFIG.CLKOUT3_REQUESTED_PHASE 270 \
  CONFIG.CLKOUT3_USED true \
  CONFIG.CLKOUT4_DRIVES BUFG \
  CONFIG.CLKOUT4_JITTER 121.076 \
  CONFIG.CLKOUT4_PHASE_ERROR 98.137 \
  CONFIG.CLKOUT4_REQUESTED_OUT_FREQ 122.88 \
  CONFIG.CLKOUT4_REQUESTED_PHASE 135 \
  CONFIG.CLKOUT4_USED true \
  CONFIG.CLKOUT5_DRIVES BUFG \
  CONFIG.CLKOUT6_DRIVES BUFG \
  CONFIG.CLKOUT7_DRIVES BUFG \
  CONFIG.FEEDBACK_SOURCE FDBK_AUTO \
  CONFIG.MMCM_CLKFBOUT_MULT_F 8.000 \
  CONFIG.MMCM_CLKIN1_PERIOD 8.138 \
  CONFIG.MMCM_CLKIN2_PERIOD 10.000 \
  CONFIG.MMCM_CLKOUT0_DIVIDE_F 8.000 \
  CONFIG.MMCM_CLKOUT1_DIVIDE 80 \
  CONFIG.MMCM_CLKOUT2_DIVIDE 8 \
  CONFIG.MMCM_CLKOUT2_PHASE 270.000 \
  CONFIG.MMCM_CLKOUT3_DIVIDE 8 \
  CONFIG.MMCM_CLKOUT3_PHASE 135.000 \
  CONFIG.MMCM_COMPENSATION ZHOLD \
  CONFIG.MMCM_DIVCLK_DIVIDE 1 \
  CONFIG.NUM_OUT_CLKS 4 \
  CONFIG.PRIMITIVE MMCM \
  CONFIG.PRIM_IN_FREQ 122.88 \
  CONFIG.PRIM_SOURCE Differential_clock_capable_pin \
  CONFIG.USE_RESET false \
] [get_bd_cells clk_wiz_0]
create_bd_cell -type ip -vlnv xilinx.com:ip:xlconstant:1.1 xlconstant_0

# ---- hierarchy /IambicKeyer ----
current_bd_instance /IambicKeyer
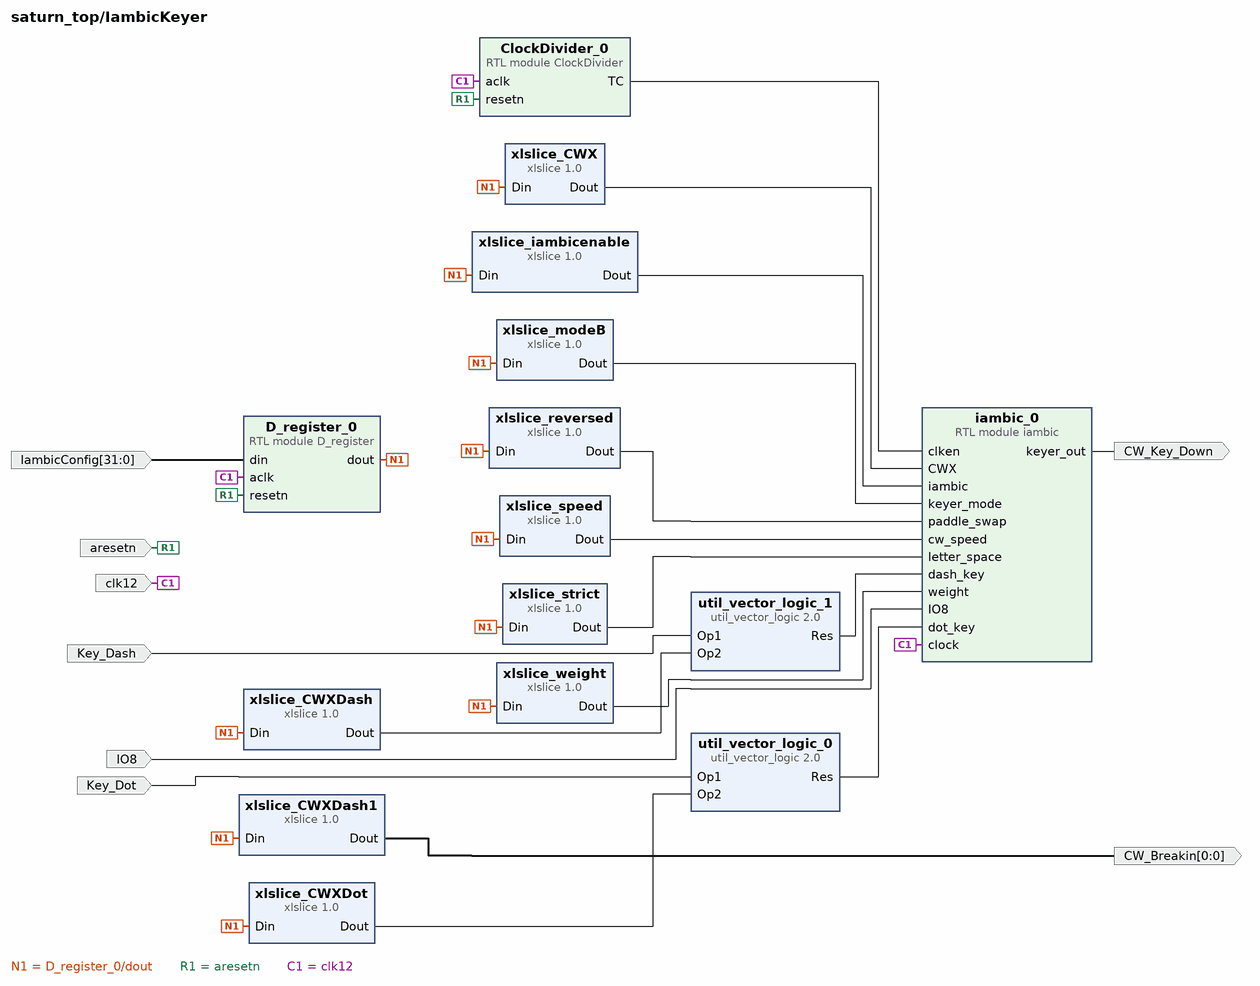
[diagram p21: block diagram inside /IambicKeyer]
create_bd_pin -dir O CW_Key_Down
create_bd_pin -dir I Key_Dash
create_bd_pin -dir I Key_Dot
create_bd_pin -dir I clk12
create_bd_pin -dir I -from 31 -to 0 IambicConfig
create_bd_pin -dir I aresetn
create_bd_pin -dir I IO8
create_bd_pin -dir O -from 0 -to 0 CW_Breakin

create_bd_cell -type ip -vlnv xilinx.com:ip:xlslice:1.0 xlslice_speed
set_property -dict {CONFIG.DIN_FROM 5 CONFIG.DOUT_WIDTH 6} [get_bd_cells xlslice_speed]
create_bd_cell -type ip -vlnv xilinx.com:ip:xlslice:1.0 xlslice_weight
set_property -dict {CONFIG.DIN_FROM 15 CONFIG.DIN_TO 8 CONFIG.DOUT_WIDTH 8} [get_bd_cells xlslice_weight]
create_bd_cell -type ip -vlnv xilinx.com:ip:xlslice:1.0 xlslice_reversed
set_property -dict {CONFIG.DIN_FROM 16 CONFIG.DIN_TO 16 CONFIG.DOUT_WIDTH 1} [get_bd_cells xlslice_reversed]
create_bd_cell -type ip -vlnv xilinx.com:ip:xlslice:1.0 xlslice_strict
set_property -dict {CONFIG.DIN_FROM 19 CONFIG.DIN_TO 19 CONFIG.DOUT_WIDTH 1} [get_bd_cells xlslice_strict]
create_bd_cell -type ip -vlnv xilinx.com:ip:xlslice:1.0 xlslice_modeB
set_property -dict {CONFIG.DIN_FROM 18 CONFIG.DIN_TO 18 CONFIG.DOUT_WIDTH 1} [get_bd_cells xlslice_modeB]
create_bd_cell -type ip -vlnv xilinx.com:ip:xlslice:1.0 xlslice_iambicenable
set_property -dict {CONFIG.DIN_FROM 17 CONFIG.DIN_TO 17 CONFIG.DOUT_WIDTH 1} [get_bd_cells xlslice_iambicenable]
create_bd_cell -type ip -vlnv xilinx.com:ip:xlslice:1.0 xlslice_CWXDash
set_property -dict {CONFIG.DIN_FROM 22 CONFIG.DIN_TO 22 CONFIG.DOUT_WIDTH 1} [get_bd_cells xlslice_CWXDash]
create_bd_cell -type ip -vlnv xilinx.com:ip:xlslice:1.0 xlslice_CWXDot
set_property -dict {CONFIG.DIN_FROM 21 CONFIG.DIN_TO 21 CONFIG.DOUT_WIDTH 1} [get_bd_cells xlslice_CWXDot]
create_bd_cell -type ip -vlnv xilinx.com:ip:xlslice:1.0 xlslice_CWX
set_property -dict {CONFIG.DIN_FROM 20 CONFIG.DIN_TO 20 CONFIG.DOUT_WIDTH 1} [get_bd_cells xlslice_CWX]
create_bd_cell -type module -reference ClockDivider ClockDivider_0
set_property -dict {CONFIG.Divisor 256} [get_bd_cells ClockDivider_0]
create_bd_cell -type ip -vlnv xilinx.com:ip:xlslice:1.0 xlslice_CWXDash1
set_property -dict {CONFIG.DIN_FROM 23 CONFIG.DIN_TO 23 CONFIG.DOUT_WIDTH 1} [get_bd_cells xlslice_CWXDash1]
create_bd_cell -type ip -vlnv xilinx.com:ip:util_vector_logic:2.0 util_vector_logic_0
set_property -dict {CONFIG.C_OPERATION or CONFIG.C_SIZE 1} [get_bd_cells util_vector_logic_0]
create_bd_cell -type ip -vlnv xilinx.com:ip:util_vector_logic:2.0 util_vector_logic_1
set_property -dict {CONFIG.C_OPERATION or CONFIG.C_SIZE 1} [get_bd_cells util_vector_logic_1]
create_bd_cell -type module -reference D_register D_register_0
set_property -dict {CONFIG.DATA_WIDTH 32} [get_bd_cells D_register_0]
create_bd_cell -type module -reference iambic iambic_0
set_property -dict {CONFIG.clock_speed 48} [get_bd_cells iambic_0]

# ---- connections ----

current_bd_instance /ADC_LVDS_Pins
connect_bd_net [get_bd_pins ADC1_CLKin_N] [get_bd_pins util_ds_buf_4/IBUF_DS_N]
connect_bd_net [get_bd_pins ADC1_CLKin_P] [get_bd_pins util_ds_buf_4/IBUF_DS_P]
connect_bd_net [get_bd_pins ADC1_In_N] [get_bd_pins selectio_wiz_0/data_in_from_pins_n]
connect_bd_net [get_bd_pins ADC1_In_P] [get_bd_pins selectio_wiz_0/data_in_from_pins_p]
connect_bd_net [get_bd_pins ADC1_Ovr_In_N] [get_bd_pins selectio_wiz_2/data_in_from_pins_n]
connect_bd_net [get_bd_pins ADC1_Ovr_In_P] [get_bd_pins selectio_wiz_2/data_in_from_pins_p]
connect_bd_net [get_bd_pins ADC2_CLKin_N] [get_bd_pins util_ds_buf_5/IBUF_DS_N]
connect_bd_net [get_bd_pins ADC2_CLKin_P] [get_bd_pins util_ds_buf_5/IBUF_DS_P]
connect_bd_net [get_bd_pins ADC2_In_N] [get_bd_pins selectio_wiz_1/data_in_from_pins_n]
connect_bd_net [get_bd_pins ADC2_In_P] [get_bd_pins selectio_wiz_1/data_in_from_pins_p]
connect_bd_net [get_bd_pins ADC2_Ovr_In_N] [get_bd_pins selectio_wiz_3/data_in_from_pins_n]
connect_bd_net [get_bd_pins ADC2_Ovr_In_P] [get_bd_pins selectio_wiz_3/data_in_from_pins_p]
connect_bd_net -net ARC_Randomise_1 [get_bd_pins adcrand] [get_bd_pins xlslice_0/Din] [get_bd_pins xlslice_1/Din]
connect_bd_net [get_bd_pins D_register_norst_2/dout] [get_bd_pins ADC1Overrange_SingleEnded]
connect_bd_net [get_bd_pins D_register_norst_3/dout] [get_bd_pins ADC2Overrange_SingleEnded]
connect_bd_net [get_bd_pins LTC2208_derandomise_0/dout] [get_bd_pins ADC1_SingleEnded]
connect_bd_net [get_bd_pins LTC2208_derandomise_1/dout] [get_bd_pins ADC2_SingleEnded]
connect_bd_net [get_bd_pins xlconstant_0/dout] \
  [get_bd_pins selectio_wiz_0/io_reset] [get_bd_pins selectio_wiz_1/io_reset] [get_bd_pins selectio_wiz_2/io_reset] \
  [get_bd_pins selectio_wiz_3/io_reset]
connect_bd_net [get_bd_pins aclk_inreg] \
  [get_bd_pins selectio_wiz_0/clk_in] [get_bd_pins selectio_wiz_1/clk_in] [get_bd_pins selectio_wiz_2/clk_in] \
  [get_bd_pins selectio_wiz_3/clk_in]
connect_bd_net [get_bd_pins aclk] \
  [get_bd_pins D_register_norst_1/aclk] [get_bd_pins D_register_norst_2/aclk] [get_bd_pins D_register_norst_3/aclk] \
  [get_bd_pins LTC2208_derandomise_1/clk] [get_bd_pins D_register_norst_0/aclk] [get_bd_pins LTC2208_derandomise_0/clk]
connect_bd_net -net adc1_1 [get_bd_pins D_register_norst_1/dout] [get_bd_pins LTC2208_derandomise_0/din]
connect_bd_net -net adc2_1 [get_bd_pins D_register_norst_0/dout] [get_bd_pins LTC2208_derandomise_1/din]
connect_bd_net [get_bd_pins selectio_wiz_0/data_in_to_device] [get_bd_pins D_register_norst_1/din]
connect_bd_net [get_bd_pins selectio_wiz_1/data_in_to_device] [get_bd_pins D_register_norst_0/din]
connect_bd_net [get_bd_pins selectio_wiz_2/data_in_to_device] [get_bd_pins D_register_norst_2/din]
connect_bd_net [get_bd_pins selectio_wiz_3/data_in_to_device] [get_bd_pins D_register_norst_3/din]
connect_bd_net [get_bd_pins xlslice_0/Dout] [get_bd_pins LTC2208_derandomise_0/rand_sel]
connect_bd_net [get_bd_pins xlslice_1/Dout] [get_bd_pins LTC2208_derandomise_1/rand_sel]

current_bd_instance /DAC_LVDS_Pins
connect_bd_net [get_bd_pins DAC_SingleEnded] [get_bd_pins selectio_wiz_0/data_out_from_device]
connect_bd_net [get_bd_pins aclk] [get_bd_pins selectio_wiz_0/clk_in]
connect_bd_net [get_bd_pins aresetn] [get_bd_pins util_vector_logic_0/Op1]
connect_bd_net [get_bd_pins selectio_wiz_0/data_out_to_pins_n] [get_bd_pins DAC_Out_N]
connect_bd_net [get_bd_pins selectio_wiz_0/data_out_to_pins_p] [get_bd_pins DAC_Out_P]
connect_bd_net [get_bd_pins util_vector_logic_0/Res] [get_bd_pins selectio_wiz_0/io_reset]

current_bd_instance /FIFO_Interfaces
connect_bd_intf_net [get_bd_intf_pins S_AXIS00_WB] [get_bd_intf_pins AXI_Stream_Reader_Wr_1/s_axis]
connect_bd_intf_net [get_bd_intf_pins M_AXIS_TX] [get_bd_intf_pins AXIS_Sizer_64to48_0/m_axis]
connect_bd_intf_net [get_bd_intf_pins AXI_Stream_Reader_Wr_0/m_axis] [get_bd_intf_pins axis_data_fifo_DUC/S_AXIS]
connect_bd_intf_net [get_bd_intf_pins AXI_Stream_Reader_Wr_codec/m_axis] [get_bd_intf_pins axis_data_fifo_codecspk/S_AXIS]
connect_bd_intf_net [get_bd_intf_pins S_AXIS_RX] [get_bd_intf_pins axis_data_fifo_DDC0/S_AXIS]
connect_bd_intf_net [get_bd_intf_pins S00_AXI_0] [get_bd_intf_pins axi_interconnect_0/S00_AXI]
connect_bd_intf_net [get_bd_intf_pins s_axi_lite_0] [get_bd_intf_pins FIFO_Monitor_0/s_axi]
connect_bd_intf_net [get_bd_intf_pins S_AXIS_codec] [get_bd_intf_pins axis_dwidth_converter_1/S_AXIS]
connect_bd_intf_net [get_bd_intf_pins AXI_Stream_Reader_Wr_0/s_axi] [get_bd_intf_pins axi_interconnect_0/M00_AXI]
connect_bd_intf_net [get_bd_intf_pins AXI_Stream_Reader_Wr_codec/s_axi] [get_bd_intf_pins axi_interconnect_0/M01_AXI]
connect_bd_intf_net [get_bd_intf_pins axi_interconnect_0/M02_AXI] [get_bd_intf_pins AXI_Stream_Reader_Wr_1/s_axi]
connect_bd_intf_net [get_bd_intf_pins AXI_Stream_Reader_Wr_0/s_axis] [get_bd_intf_pins axis_data_fifo_DDC0/M_AXIS]
connect_bd_intf_net [get_bd_intf_pins axis_data_fifo_DUC/M_AXIS] [get_bd_intf_pins AXIS_Sizer_64to48_0/s_axis]
connect_bd_intf_net [get_bd_intf_pins AXI_Stream_Reader_Wr_codec/s_axis] [get_bd_intf_pins axis_data_fifo_codecmic/M_AXIS]
connect_bd_intf_net [get_bd_intf_pins axis_data_fifo_codecspk/M_AXIS] [get_bd_intf_pins axis_dwidth_converter_64to32bit/S_AXIS]
connect_bd_intf_net [get_bd_intf_pins axis_dwidth_converter_1/M_AXIS] [get_bd_intf_pins axis_data_fifo_codecmic/S_AXIS]
connect_bd_intf_net [get_bd_intf_pins M_AXIS_codec] [get_bd_intf_pins axis_dwidth_converter_64to32bit/M_AXIS]
connect_bd_net -net ACLK_1 [get_bd_pins CLK125] \
  [get_bd_pins axi_interconnect_0/ACLK] [get_bd_pins axi_interconnect_0/S00_ACLK] [get_bd_pins axi_interconnect_0/M00_ACLK] \
  [get_bd_pins axi_interconnect_0/M01_ACLK] [get_bd_pins axis_data_fifo_DDC0/m_axis_aclk] \
  [get_bd_pins axis_data_fifo_DUC/s_axis_aclk] [get_bd_pins axis_data_fifo_codecmic/m_axis_aclk] \
  [get_bd_pins axis_data_fifo_codecspk/s_axis_aclk] [get_bd_pins axi_interconnect_0/M02_ACLK] \
  [get_bd_pins AXI_Stream_Reader_Wr_1/aclk] [get_bd_pins AXI_Stream_Reader_Wr_codec/aclk] [get_bd_pins FIFO_Monitor_0/aclk] \
  [get_bd_pins AXI_Stream_Reader_Wr_0/aclk] [get_bd_pins Watchdog_0/aclk]
connect_bd_net [get_bd_pins AXI_Stream_Reader_Wr_0/Activity] [get_bd_pins Watchdog_0/activity2]
connect_bd_net [get_bd_pins AXI_Stream_Reader_Wr_codec/Activity] [get_bd_pins Watchdog_0/activity1]
connect_bd_net -net CLK12_1 [get_bd_pins CLK12] \
  [get_bd_pins axis_data_fifo_codecmic/s_axis_aclk] [get_bd_pins axis_data_fifo_codecspk/m_axis_aclk] \
  [get_bd_pins axis_dwidth_converter_1/aclk] [get_bd_pins axis_dwidth_converter_64to32bit/aclk]
connect_bd_net [get_bd_pins CodecMicResetn] [get_bd_pins axis_data_fifo_codecmic/s_axis_aresetn]
connect_bd_net [get_bd_pins CodecSpkResetn] [get_bd_pins axis_data_fifo_codecspk/s_axis_aresetn]
connect_bd_net -net M10_ARESETN_1 [get_bd_pins aresetn_125] \
  [get_bd_pins axi_interconnect_0/ARESETN] [get_bd_pins axi_interconnect_0/S00_ARESETN] \
  [get_bd_pins axi_interconnect_0/M00_ARESETN] [get_bd_pins axi_interconnect_0/M01_ARESETN] \
  [get_bd_pins axi_interconnect_0/M02_ARESETN] [get_bd_pins AXI_Stream_Reader_Wr_1/aresetn] \
  [get_bd_pins AXI_Stream_Reader_Wr_codec/aresetn] [get_bd_pins FIFO_Monitor_0/aresetn] \
  [get_bd_pins AXI_Stream_Reader_Wr_0/aresetn] [get_bd_pins Watchdog_0/aresetn]
connect_bd_net [get_bd_pins CLK122] \
  [get_bd_pins axis_data_fifo_DDC0/s_axis_aclk] [get_bd_pins axis_data_fifo_DUC/m_axis_aclk] \
  [get_bd_pins AXIS_Sizer_64to48_0/aclk]
connect_bd_net [get_bd_pins RX_FIFO_aresetn] [get_bd_pins axis_data_fifo_DDC0/s_axis_aresetn]
connect_bd_net [get_bd_pins TX_FIFO_aresetn] [get_bd_pins axis_data_fifo_DUC/s_axis_aresetn]
connect_bd_net [get_bd_pins Watchdog_0/TXEnable] [get_bd_pins TXWatchdogEnable]
connect_bd_net -net aresetn_122_1 [get_bd_pins aresetn_122] [get_bd_pins AXIS_Sizer_64to48_0/aresetn]
connect_bd_net -net aresetn_12_1 [get_bd_pins aresetn_12] \
  [get_bd_pins axis_dwidth_converter_1/aresetn] [get_bd_pins axis_dwidth_converter_64to32bit/aresetn]
connect_bd_net [get_bd_pins axis_data_fifo_DDC0/axis_rd_data_count] [get_bd_pins FIFO_Monitor_0/fifo1_count]
connect_bd_net [get_bd_pins axis_data_fifo_DUC/axis_wr_data_count] [get_bd_pins FIFO_Monitor_0/fifo2_count]
connect_bd_net [get_bd_pins axis_data_fifo_codecmic/axis_rd_data_count] [get_bd_pins FIFO_Monitor_0/fifo3_count]
connect_bd_net [get_bd_pins axis_data_fifo_codecspk/axis_wr_data_count] [get_bd_pins FIFO_Monitor_0/fifo4_count]
connect_bd_net [get_bd_pins txmux_reset] [get_bd_pins AXIS_Sizer_64to48_0/mux_reset]
connect_bd_net [get_bd_pins xlconstant_val0/dout] \
  [get_bd_pins FIFO_Monitor_0/fifo1_overflow] [get_bd_pins FIFO_Monitor_0/fifo2_overflow] \
  [get_bd_pins FIFO_Monitor_0/fifo3_overflow] [get_bd_pins FIFO_Monitor_0/fifo4_overflow]
